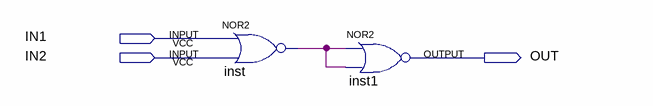
[diagram p0: schematic sheet]
// Quartus schematic my_or2.bdf as structural Verilog: 2 symbols, 3 pins
module my_or2 (
  input  IN1,
  input  IN2,
  output OUT
);

  wire inst_out;

  nor inst (inst_out, IN1, IN2);
  nor inst1 (OUT, inst_out, inst_out);
endmodule
